# EAGLE design Piano_v3.0 (EAGLE 5.11)
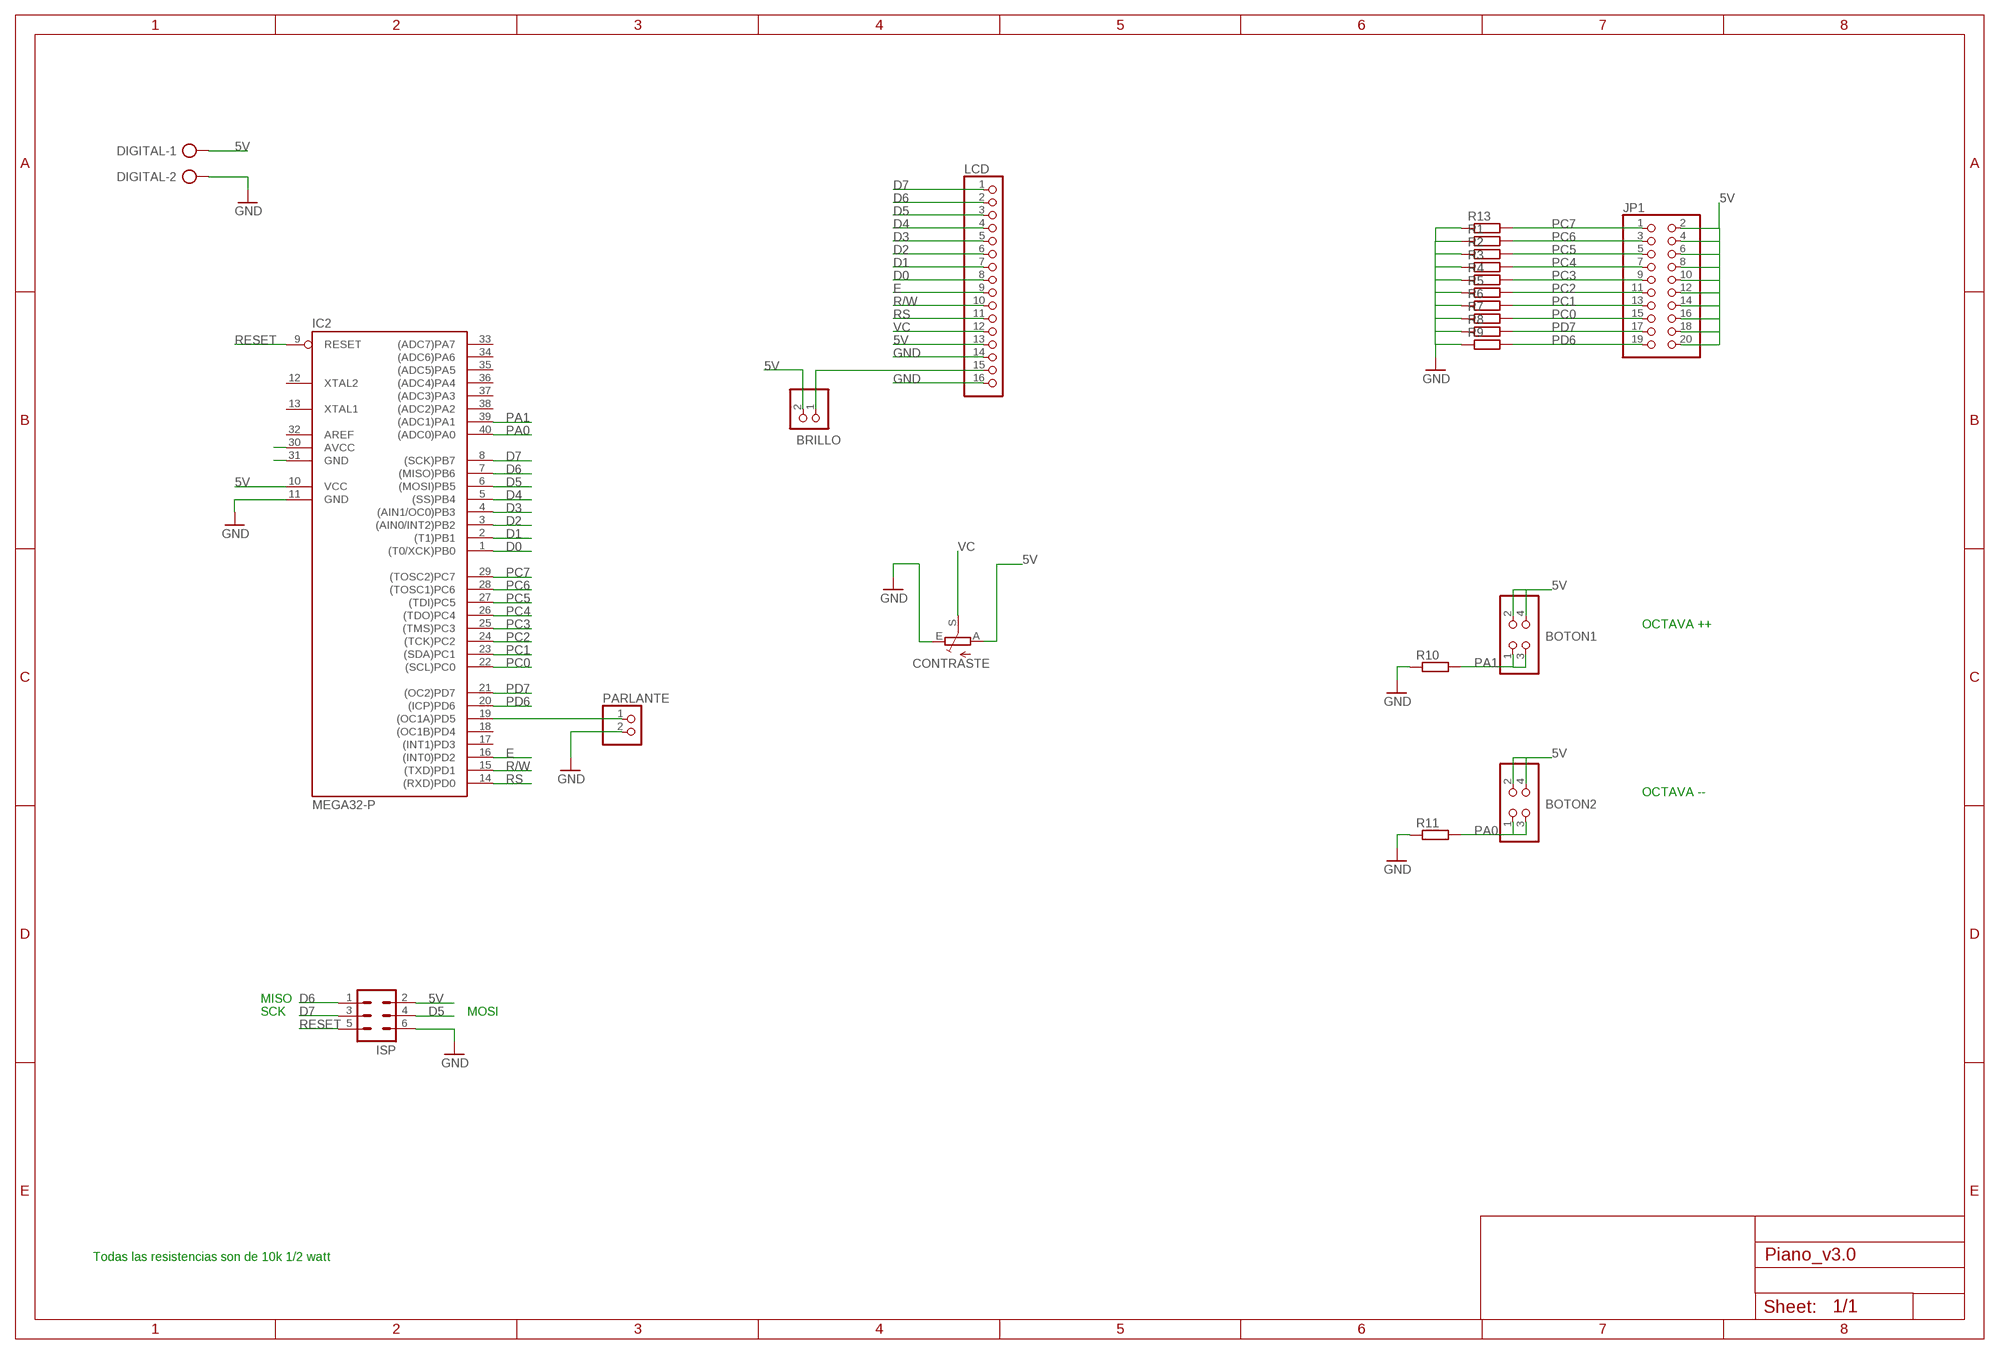
[diagram p0: schematic, sheet 1]

## Parts
BOTON1  PINHD-2X2  [2X02]
BOTON2  PINHD-2X2  [2X02]
BRILLO  PINHD-1X2  [1X02]
CONTRASTE  TRIM_EU-SP19L  [SP19L]
DIGITAL  AK300/2  [AK300/2]
IC2  MEGA32-P  [DIL40]
ISP  ML6  [ML6]
JP1  PINHD-2X10  [2X10]
LCD  PINHD-1X16  [1X16]
PARLANTE  PINHD-1X2  [1X02]
R1  R-EU_0207/15  [0207/15]
R2  R-EU_0207/15  [0207/15]
R3  R-EU_0207/15  [0207/15]
R4  R-EU_0207/15  [0207/15]
R5  R-EU_0207/15  [0207/15]
R6  R-EU_0207/15  [0207/15]
R7  R-EU_0207/15  [0207/15]
R8  R-EU_0207/15  [0207/15]
R9  R-EU_0207/15  [0207/15]
R10  R-EU_0207/15  [0207/15]
R11  R-EU_0207/15  [0207/15]
R13  R-EU_0207/15  [0207/15]

## Nets
5V: BOTON1.2 BOTON1.4 BOTON2.2 BOTON2.4 BRILLO.2 CONTRASTE.A DIGITAL.1 IC2.10(VCC) ISP.2 JP1.2 JP1.4 JP1.6 JP1.8 JP1.10 JP1.12 JP1.14 JP1.16 JP1.18 JP1.20 LCD.13
D0: IC2.1((T0/XCK)PB0) LCD.8
D1: IC2.2((T1)PB1) LCD.7
D2: IC2.3((AIN0/INT2)PB2) LCD.6
D3: IC2.4((AIN1/OC0)PB3) LCD.5
D4: IC2.5((SS)PB4) LCD.4
D5: IC2.6((MOSI)PB5) ISP.4 LCD.3
D6: IC2.7((MISO)PB6) ISP.1 LCD.2
D7: IC2.8((SCK)PB7) ISP.3 LCD.1
E: IC2.16((INT0)PD2) LCD.9
GND: CONTRASTE.E DIGITAL.2 IC2.11(GND) ISP.6 LCD.14 LCD.16 PARLANTE.2 R1.1 R2.1 R3.1 R4.1 R5.1 R6.1 R7.1 R8.1 R9.1 R10.1 R11.1 R13.1
N$1: IC2.31(GND)
N$2: IC2.19((OC1A)PD5) PARLANTE.1
N$3: BRILLO.1 LCD.15
N$4: IC2.30(AVCC)
PA0: BOTON2.1 BOTON2.3 IC2.40((ADC0)PA0) R11.2
PA1: BOTON1.1 BOTON1.3 IC2.39((ADC1)PA1) R10.2
PC0: IC2.22((SCL)PC0) JP1.15 R7.2
PC1: IC2.23((SDA)PC1) JP1.13 R6.2
PC2: IC2.24((TCK)PC2) JP1.11 R5.2
PC3: IC2.25((TMS)PC3) JP1.9 R4.2
PC4: IC2.26((TDO)PC4) JP1.7 R3.2
PC5: IC2.27((TDI)PC5) JP1.5 R2.2
PC6: IC2.28((TOSC1)PC6) JP1.3 R1.2
PC7: IC2.29((TOSC2)PC7) JP1.1 R13.2
PD6: IC2.20((ICP)PD6) JP1.19 R9.2
PD7: IC2.21((OC2)PD7) JP1.17 R8.2
R/W: IC2.15((TXD)PD1) LCD.10
RESET: IC2.9(RESET) ISP.5
RS: IC2.14((RXD)PD0) LCD.11
VC: CONTRASTE.S LCD.12
Unconnected: IC2.12(XTAL2) IC2.13(XTAL1) IC2.17((INT1)PD3) IC2.18((OC1B)PD4) IC2.32(AREF) IC2.33((ADC7)PA7) IC2.34((ADC6)PA6) IC2.35((ADC5)PA5) IC2.36((ADC4)PA4) IC2.37((ADC3)PA3) IC2.38((ADC2)PA2)

## Notes on the sheet
- OCTAVA ++
- OCTAVA --
- MISO
- SCK | MOSI
- Todas las resistencias son de 10k 1/2 watt

## Library data of the parts
BOTON1 BOTON2 = pinhead:PINHD-2X2: PIN HEADER
BRILLO PARLANTE = pinhead:PINHD-1X2: PIN HEADER
CONTRASTE = pot:TRIM_EU-: POTENTIOMETER
DIGITAL = con-ptr500:AK300/2: CONNECTOR; OC_FARNELL: unknown; OC_NEWARK: unknown
IC2 = atmel:MEGA32-P: MICROCONTROLLER 32 Kbytes FLASH 2 Kbytes SRAM 1 Kbytes EEPROM USART 8-channel 10 bit ADC Source: www.atmel.com .. doc2503.pdf; MPN: ATMEGA32-16PU; OC_FARNELL: 1661729; OC_NEWARK: 51P1794
ISP = con-harting-ml:ML6: HARTING; OC_FARNELL: unknown; OC_NEWARK: unknown
JP1 = pinhead:PINHD-2X10: PIN HEADER
LCD = pinhead:PINHD-1X16: PIN HEADER
R1-R11 R13 = rcl:R-EU_: RESISTOR, European symbol

## Board
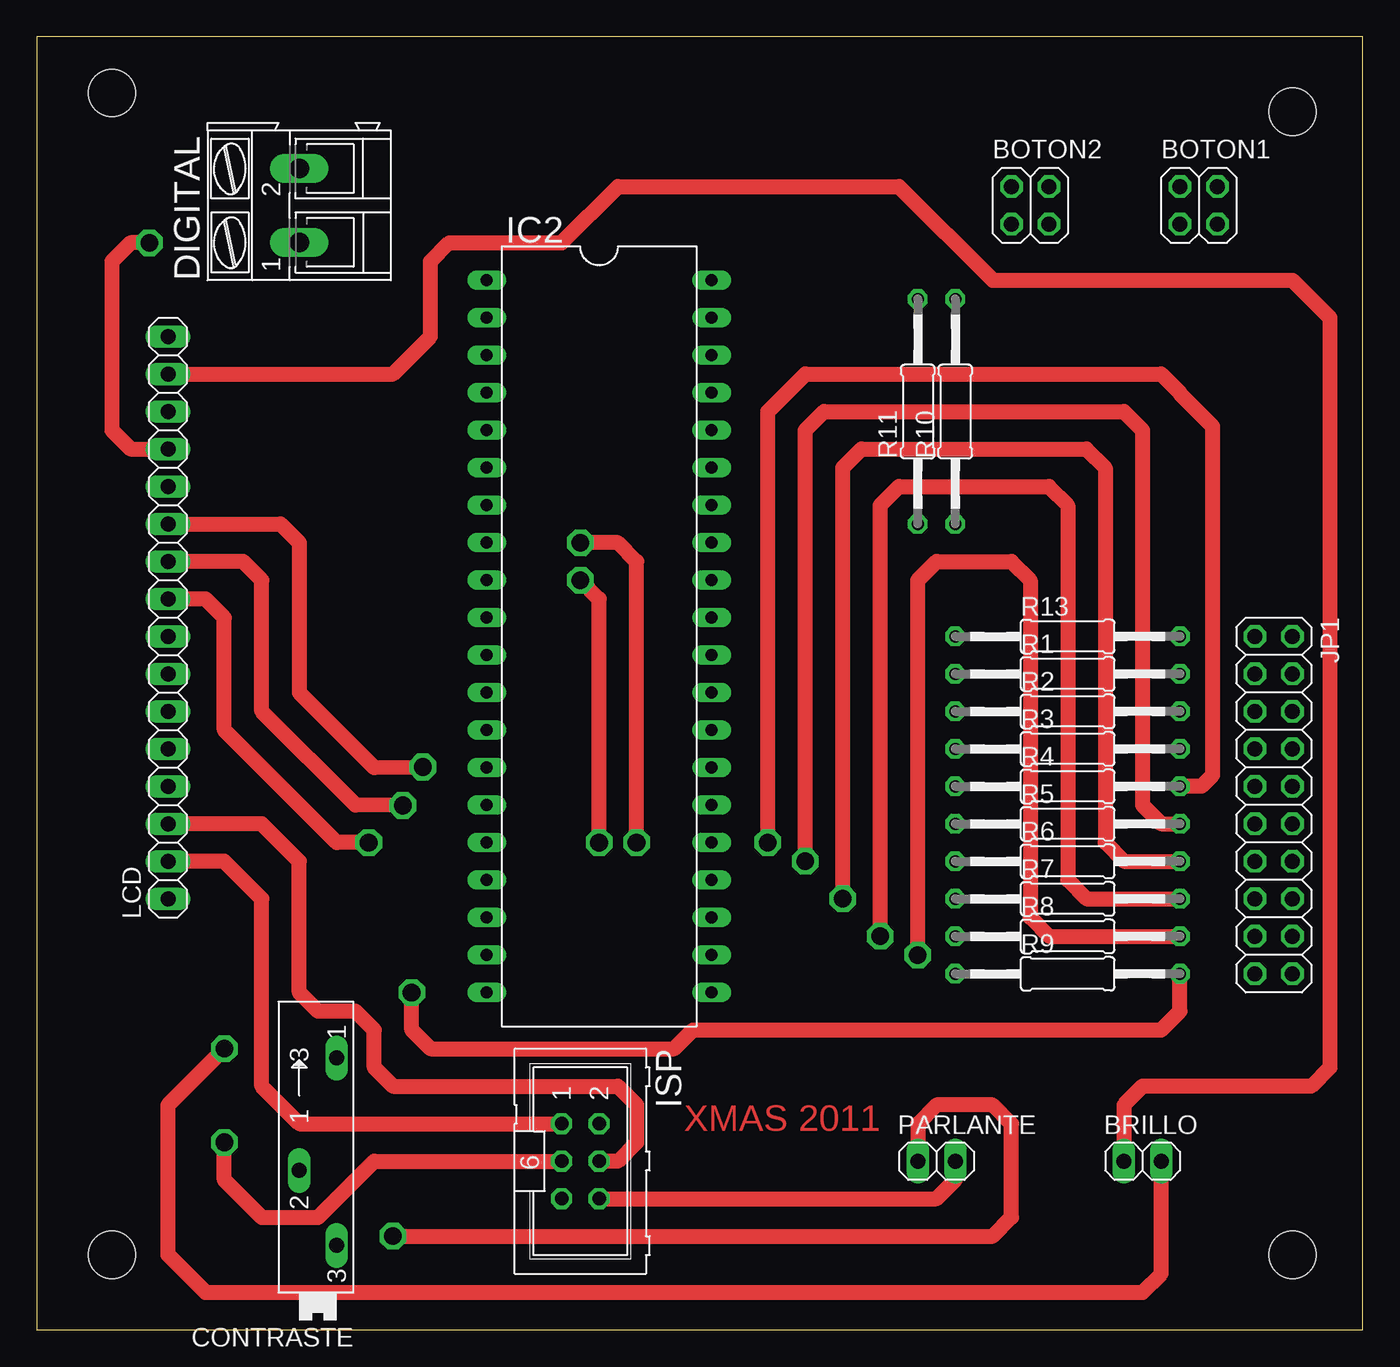
[diagram p1: board, top side]
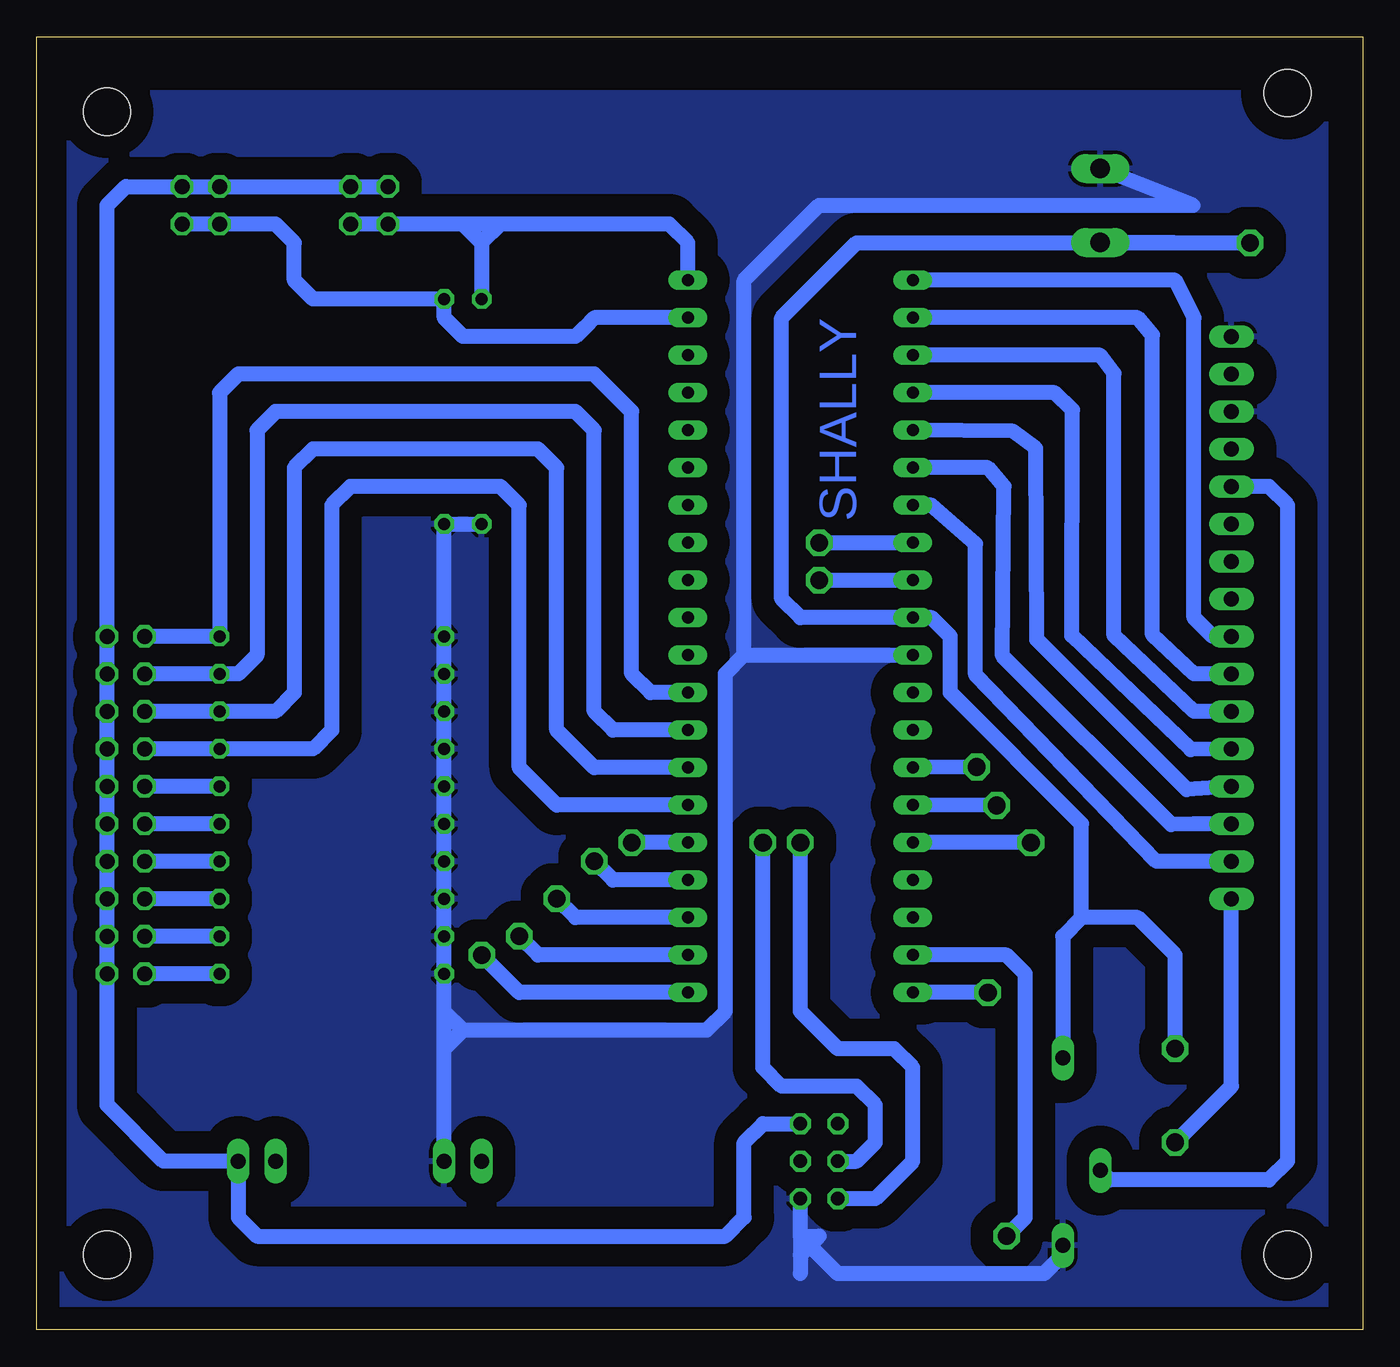
[diagram p2: board, bottom side, seen from below]

Size 89.84 x 87.62 mm. Coordinates in mm from the lower left corner, seen from the top.
Outline: 0,0 89.84,0 89.84,87.62 0,87.62 0,0
Copper layers (1*16): Top 0.035mm / dielectric 1.5mm / Bottom 0.035mm
Design rules "default *": minimum track width 10mil, minimum drill 24mil, track to track 60mil, track to pad 60mil, pad to pad 8mil, via to via 8mil, smd to smd 8mil, copper to edge 60mil, drill to drill 8mil, minimum pad ring 10mil, minimum via ring 8mil, stop-mask expansion 4mil, vias tented up to drill 0mil, thermal gap 10mil
Holes 3.2 mm at 5.08,83.82 85.09,82.55 5.08,5.08 85.09,5.08

### Footprints (pad centres in the part's own frame; a part is rotated, then mirrored left to right if it is on the bottom)
2X02 = drill 1.016 octagon: 1 -1.27,-1.27; 2 -1.27,1.27; 3 1.27,-1.27; 4 1.27,1.27
1X02 = drill 1.016 long: 1 -1.27,0; 2 1.27,0
SP19L = drill 1.016 long: A 5.715,-1.27; E -6.985,-1.27; S -1.905,1.27
AK300/2 = drill 1.321 long: 1 -2.515,0; 2 2.489,0
DIL40 = drill 0.813 long: 1 -24.13,-7.62; 2 -21.59,-7.62; 3 -19.05,-7.62; 4 -16.51,-7.62; 5 -13.97,-7.62; 6 -11.43,-7.62; 7 -8.89,-7.62; 8 -6.35,-7.62; 9 -3.81,-7.62; 10 -1.27,-7.62; 11 1.27,-7.62; 12 3.81,-7.62; 13 6.35,-7.62; 14 8.89,-7.62; 15 11.43,-7.62; 16 13.97,-7.62; 17 16.51,-7.62; 18 19.05,-7.62; 19 21.59,-7.62; 20 24.13,-7.62; 21 24.13,7.62; 22 21.59,7.62; 23 19.05,7.62; 24 16.51,7.62; 25 13.97,7.62; 26 11.43,7.62; 27 8.89,7.62; 28 6.35,7.62; 29 3.81,7.62; 30 1.27,7.62; 31 -1.27,7.62; 32 -3.81,7.62; 33 -6.35,7.62; 34 -8.89,7.62; 35 -11.43,7.62; 36 -13.97,7.62; 37 -16.51,7.62; 38 -19.05,7.62; 39 -21.59,7.62; 40 -24.13,7.62
ML6 = drill 0.914 octagon: 1 -2.54,-1.27; 2 -2.54,1.27; 3 0,-1.27; 4 0,1.27; 5 2.54,-1.27; 6 2.54,1.27
2X10 = drill 1.016 octagon: 1 -11.43,-1.27; 2 -11.43,1.27; 3 -8.89,-1.27; 4 -8.89,1.27; 5 -6.35,-1.27; 6 -6.35,1.27; 7 -3.81,-1.27; 8 -3.81,1.27; 9 -1.27,-1.27; 10 -1.27,1.27; 11 1.27,-1.27; 12 1.27,1.27; 13 3.81,-1.27; 14 3.81,1.27; 15 6.35,-1.27; 16 6.35,1.27; 17 8.89,-1.27; 18 8.89,1.27; 19 11.43,-1.27; 20 11.43,1.27
1X16 = drill 1.016 long: 1 -19.05,0; 2 -16.51,0; 3 -13.97,0; 4 -11.43,0; 5 -8.89,0; 6 -6.35,0; 7 -3.81,0; 8 -1.27,0; 9 1.27,0; 10 3.81,0; 11 6.35,0; 12 8.89,0; 13 11.43,0; 14 13.97,0; 15 16.51,0; 16 19.05,0
0207/15 = drill 0.813 octagon: 1 -7.62,0; 2 7.62,0

### Placement (x,y rotation side)
BOTON1  78.74,76.2 0 top
BOTON2  67.31,76.2 0 top
BRILLO  74.93,11.43 0 top
CONTRASTE  19.05,12.7 90 top
DIGITAL  17.78,76.2 90 top
IC2  38.1,46.99 270 top
ISP  36.83,11.43 270 top
JP1  83.82,35.56 270 top
LCD  8.89,48.26 90 top
PARLANTE  60.96,11.43 0 top
R1  69.85,44.45 0 top
R2  69.85,41.91 0 top
R3  69.85,39.37 0 top
R4  69.85,36.83 0 top
R5  69.85,34.29 0 top
R6  69.85,31.75 0 top
R7  69.85,29.21 0 top
R8  69.85,26.67 0 top
R9  69.85,24.13 0 top
R10  62.23,62.23 90 top
R11  59.69,62.23 90 top
R13  69.85,46.99 0 top

### Tracks (layer width: path | path; a pad name or v marks a point on that pad's centre or on a via)
5V  (via drill 1.2)
  Top 1.016: LCD.13 6.35,59.69 5.08,60.96 5.08,72.39 6.35,73.66 v7.62,73.66 | v12.7,19.05 8.89,15.24 8.89,5.08 11.43,2.54 74.93,2.54 76.2,3.81 BRILLO.2
  Bottom 1.016: BOTON2.2 BOTON2.4 BOTON1.2 BOTON1.4 83.82,77.47 85.09,76.2 JP1.2 JP1.4 JP1.6 JP1.8 JP1.10 JP1.12 JP1.14 JP1.16 JP1.18 JP1.20 85.09,15.24 81.28,11.43 BRILLO.2 76.2,7.62 74.93,6.35 43.18,6.35 41.91,7.62 41.91,12.7 40.64,13.97 ISP.2 | v7.62,73.66 12.68,73.66 DIGITAL.1 12.73,73.66 34.29,73.66 39.37,68.58 39.37,49.53 38.1,48.26 IC2.10 29.21,48.26 27.94,46.99 27.94,43.18 19.05,34.29 19.05,27.94 | 19.05,27.94 15.24,27.94 12.7,25.4 v12.7,19.05 | 19.05,27.94 20.32,26.67 CONTRASTE.A
D0
  Bottom 1.016: IC2.1 12.7,71.12 11.43,68.58 11.43,48.26 10.16,46.99 LCD.8
D1
  Bottom 1.016: IC2.2 15.24,68.58 14.25,67.42 14.25,47.1 11.43,44.45 LCD.7
D2
  Bottom 1.016: IC2.3 17.78,66.04 16.84,64.83 16.84,47.05 11.43,41.91 LCD.6
D3
  Bottom 1.016: IC2.4 20.87,63.5 19.66,62.34 19.71,47.05 11.65,39.31 LCD.5
D4
  Bottom 1.016: LCD.4 11.93,36.61 22.09,46.77 22.14,59.74 23.69,60.91 IC2.5
D5
  Top 1.016: ISP.4 39.37,11.43 40.64,12.7 40.64,15.24 39.37,16.51 24.13,16.51 22.86,17.78 22.86,20.32 21.59,21.59 19.05,21.59 17.78,22.86 17.78,31.75 15.24,34.29 LCD.3
  Bottom 1.016: IC2.6 25.4,58.42 24.3,57.15 24.41,45.66 12.98,34.23 LCD.3 11.43,34.29
D6
  Top 1.016: ISP.1 17.78,13.97 15.24,16.51 15.24,29.21 12.7,31.75 LCD.2
  Bottom 1.016: IC2.7 29.21,55.88 26.23,53.28 26.23,44.4 13.97,31.75 LCD.2 11.43,31.75
D7  (via drill 1.2)
  Top 1.016: v40.64,33.02 40.64,52.07 39.37,53.34 v36.83,53.34 | ISP.3 22.86,11.43 19.05,7.62 15.24,7.62 12.7,10.16 v12.7,12.7
  Bottom 1.016: ISP.3 34.29,11.43 33.02,12.7 33.02,15.24 34.29,16.51 39.37,16.51 40.64,17.78 v40.64,33.02 | v36.83,53.34 IC2.8 | LCD.1 8.89,16.51 v12.7,12.7
E  (via drill 1.2)
  Top 1.016: v22.48,33.02 20.32,33.02 12.7,40.64 12.7,48.26 11.43,49.53 LCD.9
  Bottom 1.016: v22.48,33.02 IC2.16
GND
  Top 1.016: ISP.6 60.96,8.89 62.23,10.16 PARLANTE.2
  Bottom 1.016: R11.1 R10.1 R13.1 R1.1 R2.1 R3.1 R4.1 R5.1 R6.1 R7.1 R8.1 R9.1 62.23,21.59 | DIGITAL.2 11.48,76.2 36.83,76.2 41.91,71.12 41.91,45.72 | 60.96,20.32 44.45,20.32 43.18,21.59 43.18,44.45 41.91,45.72 | 62.23,21.59 60.96,20.32 | 62.23,19.05 62.23,21.59 | 62.23,19.05 60.96,20.32 | PARLANTE.2 62.23,19.05 | 41.91,45.72 IC2.11 | CONTRASTE.E 20.32,5.08 21.59,3.81 35.56,3.81 38.1,6.35 | 38.1,6.35 38.1,5.08 | 38.1,5.08 38.1,3.81 | 38.1,5.08 36.83,6.35 38.1,6.35 | 38.1,6.35 ISP.6
  pour Bottom: 13.97,83.82 2.54,83.82 2.54,78.74 2.54,1.27 88.9,1.27 88.9,5.08 87.63,5.08 87.63,83.82
N$2  (via drill 1.2)
  Top 1.016: PARLANTE.1 59.69,13.97 60.96,15.24 64.77,15.24 66.04,13.97 66.04,7.62 64.77,6.35 v24.13,6.35
  Bottom 1.016: v24.13,6.35 22.86,7.62 22.86,24.13 24.13,25.4 IC2.19
N$3
  Top 1.016: BRILLO.1 73.66,15.24 74.93,16.51 86.36,16.51 87.63,17.78 87.63,68.58 85.09,71.12 64.77,71.12 58.42,77.47 39.37,77.47 35.56,73.66 27.94,73.66 26.67,72.39 26.67,67.31 24.13,64.77 LCD.15
PA0
  Bottom 1.016: BOTON2.3 BOTON2.1 60.96,74.93 | 58.42,74.93 50.8,74.93 49.53,74.93 46.99,74.93 45.72,73.66 IC2.40 | 58.42,74.93 59.69,73.66 | 59.69,73.66 60.96,74.93 | 58.42,74.93 60.96,74.93 | 59.69,73.66 R11.2
PA1
  Bottom 1.016: BOTON1.3 BOTON1.1 73.66,74.93 72.39,73.66 72.39,71.12 71.12,69.85 R10.2 62.23,68.58 60.96,67.31 53.34,67.31 52.7,67.94 52.07,68.58 IC2.39
PC0  (via drill 1.2)
  Top 1.016: v57.15,26.67 57.15,55.88 58.42,57.15 68.58,57.15 69.85,55.88 69.85,30.48 71.12,29.21 R7.2
  Bottom 1.016: R7.2 JP1.15 | v57.15,26.67 55.88,25.4 IC2.22
PC1  (via drill 1.2)
  Top 1.016: v54.61,29.21 54.61,58.42 55.88,59.69 71.12,59.69 72.39,58.42 72.39,33.02 73.66,31.75 R6.2
  Bottom 1.016: R6.2 JP1.13 | v54.61,29.21 53.34,27.94 IC2.23
PC2  (via drill 1.2)
  Top 1.016: v52.07,31.75 52.07,60.96 53.34,62.23 73.66,62.23 74.93,60.96 74.93,35.56 76.2,34.29 R5.2
  Bottom 1.016: R5.2 JP1.11 | v52.07,31.75 50.8,30.48 IC2.24
PC3  (via drill 1.2)
  Top 1.016: v49.53,33.02 49.53,62.23 52.07,64.77 76.2,64.77 77.47,63.5 77.47,63.44 79.66,61.24 79.66,37.57 78.92,36.83 R4.2
  Bottom 1.016: R4.2 JP1.9 | IC2.25 v49.53,33.02
PC4
  Bottom 1.016: JP1.7 R3.2 71.12,39.37 69.85,40.64 69.85,55.88 68.58,57.15 58.42,57.15 57.15,55.88 57.15,38.1 54.61,35.56 IC2.26
PC5
  Bottom 1.016: JP1.5 R2.2 73.66,41.91 72.39,43.18 72.39,58.42 71.12,59.69 55.88,59.69 54.61,58.42 54.61,40.64 52.07,38.1 IC2.27
PC6
  Bottom 1.016: JP1.3 R1.2 76.2,44.45 74.93,45.72 74.93,60.96 73.66,62.23 53.34,62.23 52.07,60.96 52.07,41.91 50.8,40.64 IC2.28
PC7
  Bottom 1.016: JP1.1 R13.2 77.47,63.5 76.2,64.77 52.07,64.77 49.53,62.23 49.53,44.45 48.26,43.18 IC2.29
PD6  (via drill 1.2)
  Top 1.016: R9.2 77.47,21.59 76.2,20.32 44.45,20.32 43.18,19.05 26.67,19.05 25.4,20.32 v25.4,22.86
  Bottom 1.016: R9.2 JP1.19 | v25.4,22.86 IC2.20
PD7  (via drill 1.2)
  Top 1.016: v59.69,25.4 59.69,50.8 60.96,52.07 66.04,52.07 67.31,50.8 67.31,27.94 68.58,26.67 R8.2
  Bottom 1.016: R8.2 JP1.17 | v59.69,25.4 57.15,22.86 IC2.21
R/W  (via drill 1.2)
  Top 1.016: v24.8,35.54 21.59,35.56 15.24,41.91 15.24,50.8 13.97,52.07 LCD.10
  Bottom 1.016: v24.8,35.54 IC2.15
RESET  (via drill 1.2)
  Top 1.016: v38.1,33.02 38.1,49.53 v36.83,50.8
  Bottom 1.016: ISP.5 33.02,8.89 30.48,11.43 30.48,17.78 31.75,19.05 35.56,19.05 38.1,21.59 v38.1,33.02 | v36.83,50.8 IC2.9
RS  (via drill 1.2)
  Top 1.016: v26.15,38.14 22.86,38.1 17.78,43.18 17.78,53.34 16.51,54.61 LCD.11
  Bottom 1.016: v26.15,38.14 IC2.14
VC
  Bottom 1.016: CONTRASTE.S 17.14,10.16 6.35,10.16 5.08,11.43 5.08,55.88 6.35,57.15 LCD.12

### Text on the board
Top: XMAS 2011
Bottom: SHALLY